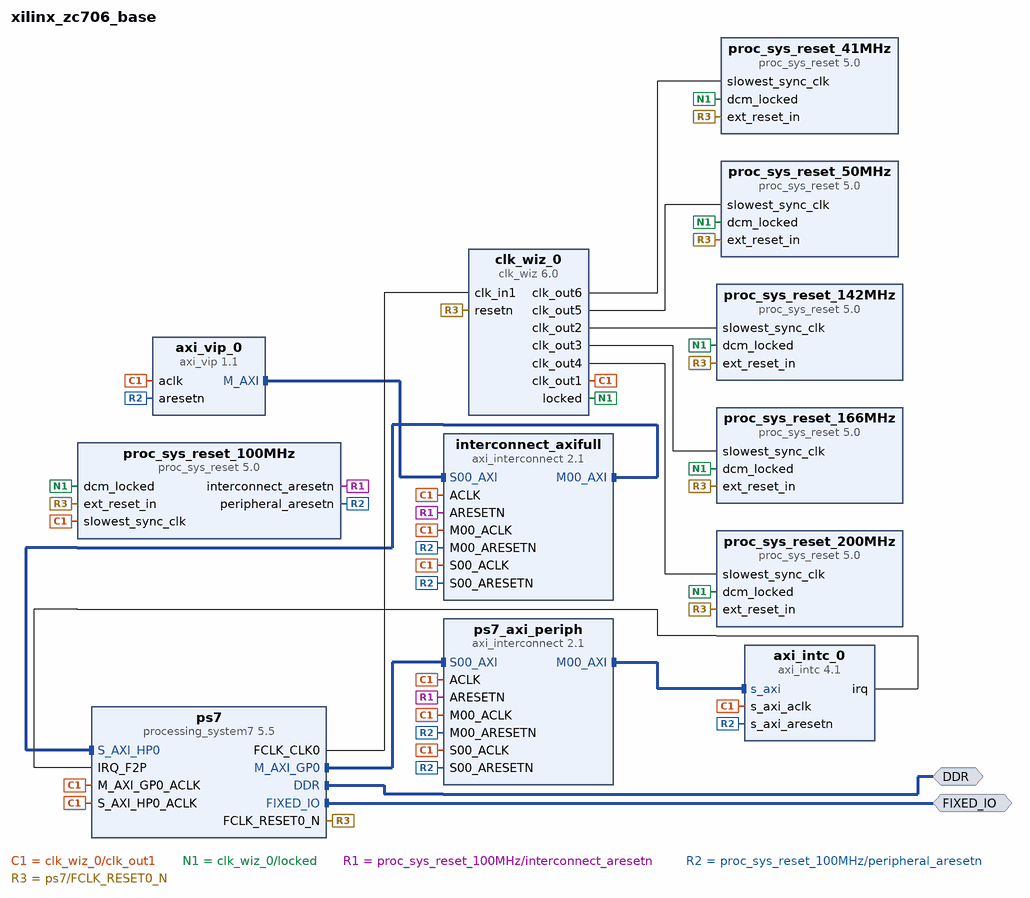
[diagram p0: block diagram of the top level]
# Vivado block design xilinx_zc706_base, xc7z045ffg900-2, Vivado 2021.2
create_bd_design xilinx_zc706_base

create_bd_intf_port -mode Master -vlnv xilinx.com:interface:ddrx_rtl:1.0 DDR
create_bd_intf_port -mode Master -vlnv xilinx.com:display_processing_system7:fixedio_rtl:1.0 FIXED_IO

create_bd_cell -type ip -vlnv xilinx.com:ip:axi_intc:4.1 axi_intc_0
set_property -dict {CONFIG.C_ASYNC_INTR 0xFFFFFFFF CONFIG.C_IRQ_CONNECTION 1} [get_bd_cells axi_intc_0]
create_bd_cell -type ip -vlnv xilinx.com:ip:axi_vip:1.1 axi_vip_0
set_property -dict [list \
  CONFIG.ADDR_WIDTH 32 \
  CONFIG.ARUSER_WIDTH 0 \
  CONFIG.AWUSER_WIDTH 0 \
  CONFIG.BUSER_WIDTH 0 \
  CONFIG.DATA_WIDTH 32 \
  CONFIG.HAS_BRESP 1 \
  CONFIG.HAS_BURST 1 \
  CONFIG.HAS_CACHE 1 \
  CONFIG.HAS_LOCK 1 \
  CONFIG.HAS_PROT 1 \
  CONFIG.HAS_QOS 1 \
  CONFIG.HAS_REGION 1 \
  CONFIG.HAS_RRESP 1 \
  CONFIG.HAS_WSTRB 1 \
  CONFIG.ID_WIDTH 0 \
  CONFIG.INTERFACE_MODE MASTER \
  CONFIG.PROTOCOL AXI4 \
  CONFIG.READ_WRITE_MODE READ_WRITE \
  CONFIG.RUSER_BITS_PER_BYTE 0 \
  CONFIG.RUSER_WIDTH 0 \
  CONFIG.SUPPORTS_NARROW 1 \
  CONFIG.WUSER_BITS_PER_BYTE 0 \
  CONFIG.WUSER_WIDTH 0 \
] [get_bd_cells axi_vip_0]
create_bd_cell -type ip -vlnv xilinx.com:ip:clk_wiz:6.0 clk_wiz_0
set_property -dict [list \
  CONFIG.CLKOUT1_JITTER 162.035 \
  CONFIG.CLKOUT1_PHASE_ERROR 164.985 \
  CONFIG.CLKOUT1_REQUESTED_OUT_FREQ 100 \
  CONFIG.CLKOUT2_JITTER 150.257 \
  CONFIG.CLKOUT2_PHASE_ERROR 164.985 \
  CONFIG.CLKOUT2_REQUESTED_OUT_FREQ 142 \
  CONFIG.CLKOUT2_USED true \
  CONFIG.CLKOUT3_JITTER 146.458 \
  CONFIG.CLKOUT3_PHASE_ERROR 164.985 \
  CONFIG.CLKOUT3_REQUESTED_OUT_FREQ 166 \
  CONFIG.CLKOUT3_USED true \
  CONFIG.CLKOUT4_JITTER 142.107 \
  CONFIG.CLKOUT4_PHASE_ERROR 164.985 \
  CONFIG.CLKOUT4_REQUESTED_OUT_FREQ 200 \
  CONFIG.CLKOUT4_USED true \
  CONFIG.CLKOUT5_JITTER 192.113 \
  CONFIG.CLKOUT5_PHASE_ERROR 164.985 \
  CONFIG.CLKOUT5_REQUESTED_OUT_FREQ 50 \
  CONFIG.CLKOUT5_USED true \
  CONFIG.CLKOUT6_JITTER 202.017 \
  CONFIG.CLKOUT6_PHASE_ERROR 164.985 \
  CONFIG.CLKOUT6_REQUESTED_OUT_FREQ 41 \
  CONFIG.CLKOUT6_USED true \
  CONFIG.MMCM_CLKFBOUT_MULT_F 20.000 \
  CONFIG.MMCM_CLKOUT0_DIVIDE_F 10.000 \
  CONFIG.MMCM_CLKOUT1_DIVIDE 7 \
  CONFIG.MMCM_CLKOUT2_DIVIDE 6 \
  CONFIG.MMCM_CLKOUT3_DIVIDE 5 \
  CONFIG.MMCM_CLKOUT4_DIVIDE 20 \
  CONFIG.MMCM_CLKOUT5_DIVIDE 24 \
  CONFIG.NUM_OUT_CLKS 6 \
  CONFIG.RESET_TYPE ACTIVE_LOW \
] [get_bd_cells clk_wiz_0]
create_bd_cell -type ip -vlnv xilinx.com:ip:axi_interconnect:2.1 interconnect_axifull
set_property -dict {CONFIG.NUM_MI 1 CONFIG.NUM_SI 1} [get_bd_cells interconnect_axifull]
create_bd_cell -type ip -vlnv xilinx.com:ip:proc_sys_reset:5.0 proc_sys_reset_100MHz
create_bd_cell -type ip -vlnv xilinx.com:ip:proc_sys_reset:5.0 proc_sys_reset_142MHz
create_bd_cell -type ip -vlnv xilinx.com:ip:proc_sys_reset:5.0 proc_sys_reset_166MHz
create_bd_cell -type ip -vlnv xilinx.com:ip:proc_sys_reset:5.0 proc_sys_reset_200MHz
create_bd_cell -type ip -vlnv xilinx.com:ip:proc_sys_reset:5.0 proc_sys_reset_41MHz
create_bd_cell -type ip -vlnv xilinx.com:ip:proc_sys_reset:5.0 proc_sys_reset_50MHz
create_bd_cell -type ip -vlnv xilinx.com:ip:processing_system7:5.5 ps7
set_property -dict [list \
  CONFIG.PCW_APU_PERIPHERAL_FREQMHZ 667.000000 \
  CONFIG.PCW_DUAL_PARALLEL_QSPI_DATA_MODE x8 \
  CONFIG.PCW_ENET0_ENET0_IO {MIO 16 .. 27} \
  CONFIG.PCW_ENET0_GRP_MDIO_ENABLE 1 \
  CONFIG.PCW_ENET0_GRP_MDIO_IO {MIO 52 .. 53} \
  CONFIG.PCW_ENET0_PERIPHERAL_ENABLE 1 \
  CONFIG.PCW_ENET0_PERIPHERAL_FREQMHZ {100 Mbps} \
  CONFIG.PCW_ENET0_RESET_ENABLE 1 \
  CONFIG.PCW_ENET0_RESET_IO {MIO 47} \
  CONFIG.PCW_ENET_RESET_ENABLE 1 \
  CONFIG.PCW_ENET_RESET_SELECT {Share reset pin} \
  CONFIG.PCW_GPIO_MIO_GPIO_ENABLE 1 \
  CONFIG.PCW_GPIO_MIO_GPIO_IO MIO \
  CONFIG.PCW_I2C0_GRP_INT_ENABLE 0 \
  CONFIG.PCW_I2C0_I2C0_IO {MIO 50 .. 51} \
  CONFIG.PCW_I2C0_PERIPHERAL_ENABLE 1 \
  CONFIG.PCW_I2C0_RESET_ENABLE 1 \
  CONFIG.PCW_I2C0_RESET_IO {MIO 46} \
  CONFIG.PCW_I2C_PERIPHERAL_FREQMHZ 111.111115 \
  CONFIG.PCW_I2C_RESET_ENABLE 1 \
  CONFIG.PCW_I2C_RESET_SELECT {Share reset pin} \
  CONFIG.PCW_IRQ_F2P_INTR 1 \
  CONFIG.PCW_PRESET_BANK0_VOLTAGE {LVCMOS 1.8V} \
  CONFIG.PCW_PRESET_BANK1_VOLTAGE {LVCMOS 1.8V} \
  CONFIG.PCW_QSPI_GRP_FBCLK_ENABLE 1 \
  CONFIG.PCW_QSPI_GRP_FBCLK_IO {MIO 8} \
  CONFIG.PCW_QSPI_GRP_IO1_ENABLE 1 \
  CONFIG.PCW_QSPI_GRP_IO1_IO {MIO 0 9 .. 13} \
  CONFIG.PCW_QSPI_GRP_SINGLE_SS_ENABLE 0 \
  CONFIG.PCW_QSPI_INTERNAL_HIGHADDRESS 0xFDFFFFFF \
  CONFIG.PCW_QSPI_PERIPHERAL_ENABLE 1 \
  CONFIG.PCW_QSPI_QSPI_IO {MIO 1 .. 6} \
  CONFIG.PCW_SD0_GRP_CD_ENABLE 1 \
  CONFIG.PCW_SD0_GRP_CD_IO {MIO 14} \
  CONFIG.PCW_SD0_GRP_WP_ENABLE 1 \
  CONFIG.PCW_SD0_GRP_WP_IO {MIO 15} \
  CONFIG.PCW_SD0_PERIPHERAL_ENABLE 1 \
  CONFIG.PCW_SD0_SD0_IO {MIO 40 .. 45} \
  CONFIG.PCW_SDIO_PERIPHERAL_FREQMHZ 50 \
  CONFIG.PCW_TTC0_PERIPHERAL_ENABLE 1 \
  CONFIG.PCW_TTC0_TTC0_IO EMIO \
  CONFIG.PCW_UART1_PERIPHERAL_ENABLE 1 \
  CONFIG.PCW_UART1_UART1_IO {MIO 48 .. 49} \
  CONFIG.PCW_UART_PERIPHERAL_FREQMHZ 50 \
  CONFIG.PCW_UIPARAM_DDR_FREQ_MHZ 533.333313 \
  CONFIG.PCW_UIPARAM_DDR_PARTNO Custom \
  CONFIG.PCW_USB0_PERIPHERAL_ENABLE 1 \
  CONFIG.PCW_USB0_RESET_ENABLE 1 \
  CONFIG.PCW_USB0_RESET_IO {MIO 7} \
  CONFIG.PCW_USB0_USB0_IO {MIO 28 .. 39} \
  CONFIG.PCW_USB_RESET_ENABLE 1 \
  CONFIG.PCW_USB_RESET_SELECT {Share reset pin} \
  CONFIG.PCW_USE_FABRIC_INTERRUPT 1 \
  CONFIG.PCW_USE_S_AXI_HP0 1 \
  CONFIG.preset ZC706 \
] [get_bd_cells ps7]
# 235 more settings of ps7 are not shown: defaults, MIO pin electricals, DDR timing, and values the tool derives
create_bd_cell -type ip -vlnv xilinx.com:ip:axi_interconnect:2.1 ps7_axi_periph
set_property -dict {CONFIG.NUM_MI 1} [get_bd_cells ps7_axi_periph]

# ---- connections ----

connect_bd_intf_net -intf_net axi_interconnect_0_M00_AXI [get_bd_intf_pins interconnect_axifull/M00_AXI] [get_bd_intf_pins ps7/S_AXI_HP0]
connect_bd_intf_net [get_bd_intf_pins axi_vip_0/M_AXI] [get_bd_intf_pins interconnect_axifull/S00_AXI]
connect_bd_intf_net -intf_net processing_system7_1_DDR [get_bd_intf_ports DDR] [get_bd_intf_pins ps7/DDR]
connect_bd_intf_net -intf_net processing_system7_1_FIXED_IO [get_bd_intf_ports FIXED_IO] [get_bd_intf_pins ps7/FIXED_IO]
connect_bd_intf_net [get_bd_intf_pins ps7/M_AXI_GP0] [get_bd_intf_pins ps7_axi_periph/S00_AXI]
connect_bd_intf_net [get_bd_intf_pins axi_intc_0/s_axi] [get_bd_intf_pins ps7_axi_periph/M00_AXI]
connect_bd_net [get_bd_pins axi_intc_0/irq] [get_bd_pins ps7/IRQ_F2P]
connect_bd_net [get_bd_pins clk_wiz_0/clk_out1] \
  [get_bd_pins axi_intc_0/s_axi_aclk] [get_bd_pins axi_vip_0/aclk] [get_bd_pins interconnect_axifull/ACLK] \
  [get_bd_pins interconnect_axifull/M00_ACLK] [get_bd_pins interconnect_axifull/S00_ACLK] \
  [get_bd_pins proc_sys_reset_100MHz/slowest_sync_clk] [get_bd_pins ps7/M_AXI_GP0_ACLK] [get_bd_pins ps7/S_AXI_HP0_ACLK] \
  [get_bd_pins ps7_axi_periph/ACLK] [get_bd_pins ps7_axi_periph/M00_ACLK] [get_bd_pins ps7_axi_periph/S00_ACLK]
connect_bd_net [get_bd_pins clk_wiz_0/clk_out2] [get_bd_pins proc_sys_reset_142MHz/slowest_sync_clk]
connect_bd_net [get_bd_pins clk_wiz_0/clk_out3] [get_bd_pins proc_sys_reset_166MHz/slowest_sync_clk]
connect_bd_net [get_bd_pins clk_wiz_0/clk_out4] [get_bd_pins proc_sys_reset_200MHz/slowest_sync_clk]
connect_bd_net [get_bd_pins clk_wiz_0/clk_out5] [get_bd_pins proc_sys_reset_50MHz/slowest_sync_clk]
connect_bd_net [get_bd_pins clk_wiz_0/clk_out6] [get_bd_pins proc_sys_reset_41MHz/slowest_sync_clk]
connect_bd_net [get_bd_pins clk_wiz_0/locked] \
  [get_bd_pins proc_sys_reset_100MHz/dcm_locked] [get_bd_pins proc_sys_reset_142MHz/dcm_locked] \
  [get_bd_pins proc_sys_reset_166MHz/dcm_locked] [get_bd_pins proc_sys_reset_200MHz/dcm_locked] \
  [get_bd_pins proc_sys_reset_41MHz/dcm_locked] [get_bd_pins proc_sys_reset_50MHz/dcm_locked]
connect_bd_net -net proc_sys_reset_0_interconnect_aresetn [get_bd_pins proc_sys_reset_100MHz/interconnect_aresetn] \
  [get_bd_pins interconnect_axifull/ARESETN] [get_bd_pins ps7_axi_periph/ARESETN]
connect_bd_net -net proc_sys_reset_0_peripheral_aresetn [get_bd_pins proc_sys_reset_100MHz/peripheral_aresetn] \
  [get_bd_pins axi_intc_0/s_axi_aresetn] [get_bd_pins axi_vip_0/aresetn] [get_bd_pins interconnect_axifull/M00_ARESETN] \
  [get_bd_pins interconnect_axifull/S00_ARESETN] [get_bd_pins ps7_axi_periph/M00_ARESETN] \
  [get_bd_pins ps7_axi_periph/S00_ARESETN]
connect_bd_net [get_bd_pins ps7/FCLK_CLK0] [get_bd_pins clk_wiz_0/clk_in1]
connect_bd_net [get_bd_pins ps7/FCLK_RESET0_N] \
  [get_bd_pins clk_wiz_0/resetn] [get_bd_pins proc_sys_reset_100MHz/ext_reset_in] \
  [get_bd_pins proc_sys_reset_142MHz/ext_reset_in] [get_bd_pins proc_sys_reset_166MHz/ext_reset_in] \
  [get_bd_pins proc_sys_reset_200MHz/ext_reset_in] [get_bd_pins proc_sys_reset_41MHz/ext_reset_in] \
  [get_bd_pins proc_sys_reset_50MHz/ext_reset_in]
set_property PFM.IRQ {intr {id 0 range 32}} [get_bd_cells axi_intc_0]
set_property PFM.CLOCK {clk_out1 {id "2" is_default "true" proc_sys_reset "proc_sys_reset_100MHz" status "fixed"} clk_out2 {id "1" is_default "false" proc_sys_reset "proc_sys_reset_142MHz" status "fixed"} clk_out3 {id "0" is_default "false" proc_sys_reset "proc_sys_reset_142MHz" status "fixed"} clk_out4 {id "3" is_default "false" proc_sys_reset "proc_sys_reset_200MHz" status "fixed"} clk_out5 {id "4" is_default "false" proc_sys_reset "proc_sys_reset_50MHz" status "fixed"} clk_out6 {id "5" is_default "false" proc_sys_reset "proc_sys_reset_41MHz" status "fixed"}} [get_bd_cells clk_wiz_0]
set_property HDL_ATTRIBUTE.DPA_TRACE_SLAVE true [get_bd_cells interconnect_axifull]
set_property PFM.AXI_PORT {S01_AXI {memport "S_AXI_HP" sptag "HP0" memory "ps7 HP0_DDR_LOWOCM"} S02_AXI {memport "S_AXI_HP" sptag "HP0" memory "ps7 HP0_DDR_LOWOCM"} S03_AXI {memport "S_AXI_HP" sptag "HP0" memory "ps7 HP0_DDR_LOWOCM"} S04_AXI {memport "S_AXI_HP" sptag "HP0" memory "ps7 HP0_DDR_LOWOCM"} S05_AXI {memport "S_AXI_HP" sptag "HP0" memory "ps7 HP0_DDR_LOWOCM"} S06_AXI {memport "S_AXI_HP" sptag "HP0" memory "ps7 HP0_DDR_LOWOCM"} S07_AXI {memport "S_AXI_HP" sptag "HP0" memory "ps7 HP0_DDR_LOWOCM"} S08_AXI {memport "S_AXI_HP" sptag "HP0" memory "ps7 HP0_DDR_LOWOCM"} S09_AXI {memport "S_AXI_HP" sptag "HP0" memory "ps7 HP0_DDR_LOWOCM"} S10_AXI {memport "S_AXI_HP" sptag "HP0" memory "ps7 HP0_DDR_LOWOCM"} S11_AXI {memport "S_AXI_HP" sptag "HP0" memory "ps7 HP0_DDR_LOWOCM"} S12_AXI {memport "S_AXI_HP" sptag "HP0" memory "ps7 HP0_DDR_LOWOCM"} S13_AXI {memport "S_AXI_HP" sptag "HP0" memory "ps7 HP0_DDR_LOWOCM"} S14_AXI {memport "S_AXI_HP" sptag "HP0" memory "ps7 HP0_DDR_LOWOCM"} S15_AXI {memport "S_AXI_HP" sptag "HP0" memory "ps7 HP0_DDR_LOWOCM"}} [get_bd_cells interconnect_axifull]
set_property PFM.AXI_PORT {M_AXI_GP1 {memport "M_AXI_GP" sptag "GP" memory ""} S_AXI_HP1 {memport "S_AXI_HP" sptag "HP1" memory "ps7 HP1_DDR_LOWOCM"} S_AXI_HP2 {memport "S_AXI_HP" sptag "HP2" memory "ps7 HP2_DDR_LOWOCM"} S_AXI_HP3 {memport "S_AXI_HP" sptag "HP3" memory "ps7 HP3_DDR_LOWOCM"}} [get_bd_cells ps7]
set_property HDL_ATTRIBUTE.DPA_AXILITE_MASTER fallback [get_bd_cells ps7_axi_periph]
set_property PFM.AXI_PORT {M01_AXI {memport "M_AXI_GP" sptag "" memory ""} M02_AXI {memport "M_AXI_GP" sptag "" memory ""} M03_AXI {memport "M_AXI_GP" sptag "" memory ""} M04_AXI {memport "M_AXI_GP" sptag "" memory ""} M05_AXI {memport "M_AXI_GP" sptag "" memory ""} M06_AXI {memport "M_AXI_GP" sptag "" memory ""} M07_AXI {memport "M_AXI_GP" sptag "" memory ""} M08_AXI {memport "M_AXI_GP" sptag "" memory ""} M09_AXI {memport "M_AXI_GP" sptag "" memory ""} M10_AXI {memport "M_AXI_GP" sptag "" memory ""} M11_AXI {memport "M_AXI_GP" sptag "" memory ""} M12_AXI {memport "M_AXI_GP" sptag "" memory ""} M13_AXI {memport "M_AXI_GP" sptag "" memory ""} M14_AXI {memport "M_AXI_GP" sptag "" memory ""} M15_AXI {memport "M_AXI_GP" sptag "" memory ""} M16_AXI {memport "M_AXI_GP" sptag "" memory ""} M17_AXI {memport "M_AXI_GP" sptag "" memory ""} M18_AXI {memport "M_AXI_GP" sptag "" memory ""} M19_AXI {memport "M_AXI_GP" sptag "" memory ""} M20_AXI {memport "M_AXI_GP" sptag "" memory ""} M21_AXI {memport "M_AXI_GP" sptag "" memory ""} M22_AXI {memport "M_AXI_GP" sptag "" memory ""} M23_AXI {memport "M_AXI_GP" sptag "" memory ""} M24_AXI {memport "M_AXI_GP" sptag "" memory ""} M25_AXI {memport "M_AXI_GP" sptag "" memory ""} M26_AXI {memport "M_AXI_GP" sptag "" memory ""} M27_AXI {memport "M_AXI_GP" sptag "" memory ""} M28_AXI {memport "M_AXI_GP" sptag "" memory ""} M29_AXI {memport "M_AXI_GP" sptag "" memory ""} M30_AXI {memport "M_AXI_GP" sptag "" memory ""} M31_AXI {memport "M_AXI_GP" sptag "" memory ""}} [get_bd_cells ps7_axi_periph]

# ---- address map ----
assign_bd_address -offset 0x00000000 -range 1G -target_address_space [get_bd_addr_spaces axi_vip_0/Master_AXI] [get_bd_addr_segs ps7/S_AXI_HP0/HP0_DDR_LOWOCM]
assign_bd_address -offset 0x70000000 -range 64K -target_address_space [get_bd_addr_spaces ps7/Data] [get_bd_addr_segs axi_intc_0/S_AXI/Reg]

validate_bd_design
save_bd_design
